# Altium project BlueSat_FlatSat.PrjPCB
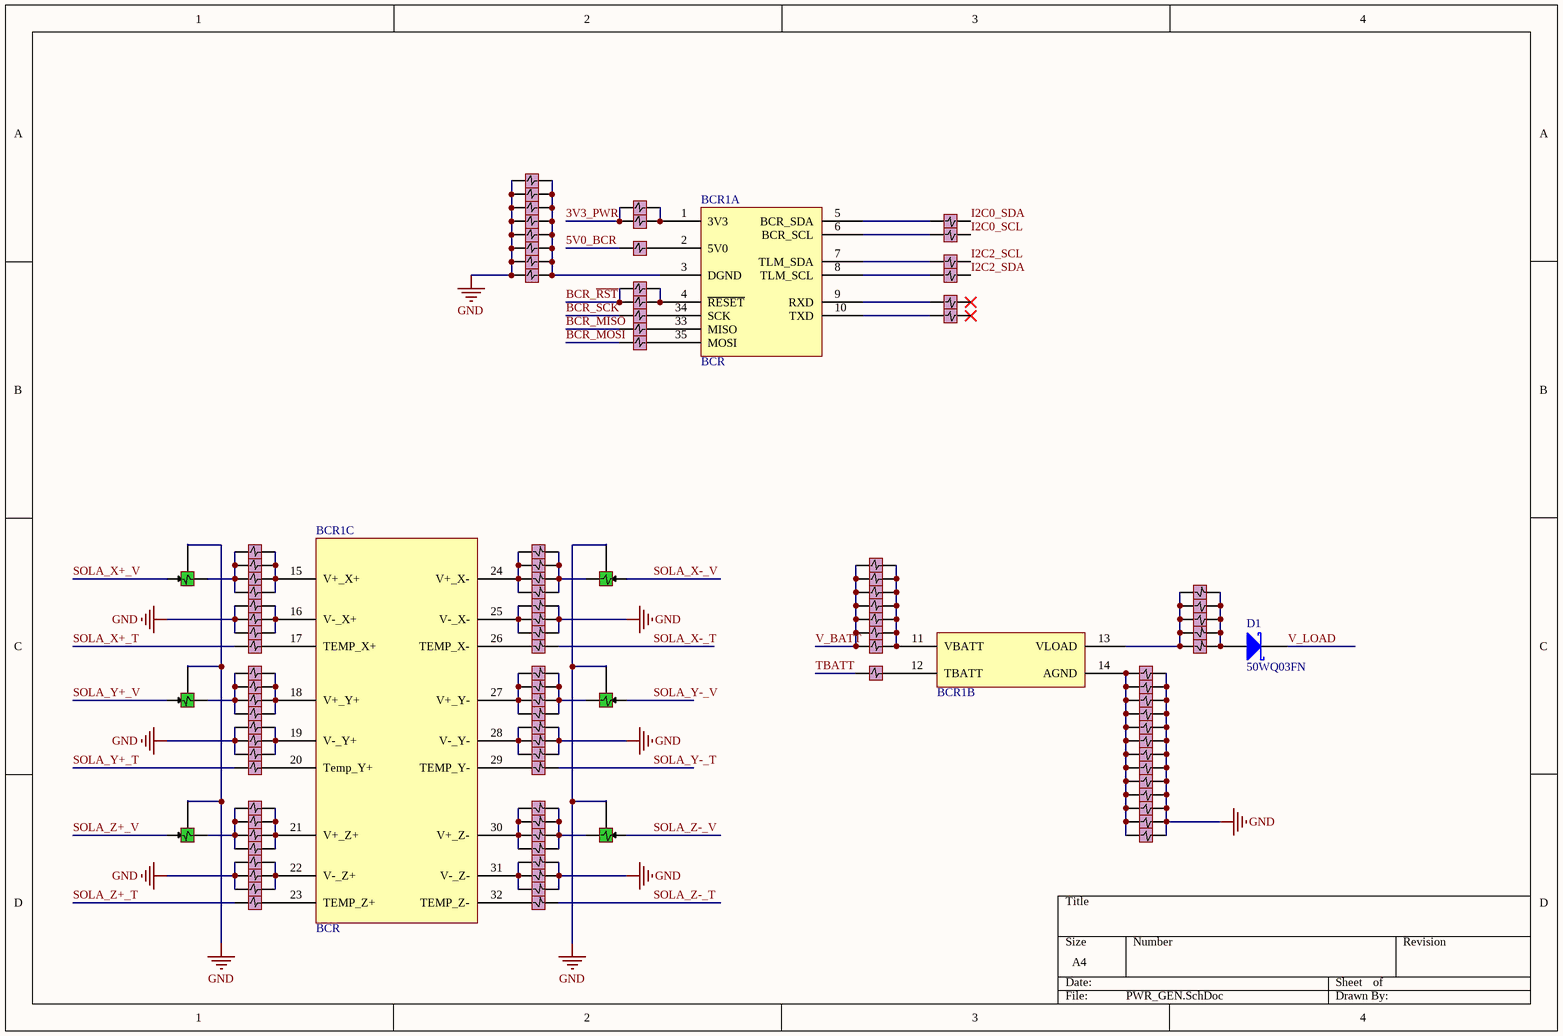
[diagram p0: PWR_GEN.SchDoc]
3 sheets, 393 parts. Net scope: global (net labels, ports and power ports of the same name join across sheets).
Board files: FLATSAT.PcbDoc, CSC_TEMP.PcbDoc, BBONE_TEMP.PcbDoc, COMMS_TEMP.PcbDoc, PWR_REG_TEMP.PcbDoc, PWR_GEN_TEMP.PcbDoc, LAYOUT_TEMP.PcbDoc
Sheets:
  PWR_GEN.SchDoc
  PWR_REG.SchDoc
  LED_INDICATORS.SchDoc

## Sheet PWR_GEN.SchDoc
size A4; DocumentNumber: 1; SheetNumber: 4; SheetTotal: 6

### Parts
BCR1  BCR  [BCR_FLATSAT_BOARD]  (parts A,B,C of 3)
D1  50WQ03FN  [TO229P990X238-3N]
F15  FilterSola  [FILTERSOLA]  (value not drawn)
F16  FilterSola  [FILTERSOLA]  (value not drawn)
F17  FilterSola  [FILTERSOLA]  (value not drawn)
F18  FilterSola  [FILTERSOLA]  (value not drawn)
F19  FilterSola  [FILTERSOLA]  (value not drawn)
F20  FilterSola  [FILTERSOLA]  (value not drawn)
P337  Jumper_Filter  [Jumper_filter]  (value not drawn)
P338  Jumper_Filter  [Jumper_filter]  (value not drawn)
P339  Jumper_Filter  [Jumper_filter]  (value not drawn)
P340  Jumper_Filter  [Jumper_filter]  (value not drawn)
P341  Jumper_Filter  [Jumper_filter]  (value not drawn)
P342  Jumper_Filter  [Jumper_filter]  (value not drawn)
P343  Jumper_Filter  [Jumper_filter]  (value not drawn)
P344  Jumper_Filter  [Jumper_filter]  (value not drawn)
P345  Jumper_Filter  [Jumper_filter]  (value not drawn)
P346  Jumper_Filter  [Jumper_filter]  (value not drawn)
P347  Jumper_Filter  [Jumper_filter]  (value not drawn)
P348  Jumper_Filter  [Jumper_filter]  (value not drawn)
P349  Jumper_Filter  [Jumper_filter]  (value not drawn)
P350  Jumper_Filter  [Jumper_filter]  (value not drawn)
P351  Jumper_Filter  [Jumper_filter]  (value not drawn)
P352  Jumper_Filter  [Jumper_filter]  (value not drawn)
P353  Jumper_Filter  [Jumper_filter]  (value not drawn)
P354  Jumper_Filter  [Jumper_filter]  (value not drawn)
P355  Jumper_Filter  [Jumper_filter]  (value not drawn)
P356  Jumper_Filter  [Jumper_filter]  (value not drawn)
P357  Jumper_Filter  [Jumper_filter]  (value not drawn)
P358  Jumper_Filter  [Jumper_filter]  (value not drawn)
P359  Jumper_Filter  [Jumper_filter]  (value not drawn)
P360  Jumper_Filter  [Jumper_filter]  (value not drawn)
P361  Jumper_Filter  [Jumper_filter]  (value not drawn)
P362  Jumper_Filter  [Jumper_filter]  (value not drawn)
P363  Jumper_Filter  [Jumper_filter]  (value not drawn)
P364  Jumper_Filter  [Jumper_filter]  (value not drawn)
P365  Jumper_Filter  [Jumper_filter]  (value not drawn)
P366  Jumper_Filter  [Jumper_filter]  (value not drawn)
P367  Jumper_Filter  [Jumper_filter]  (value not drawn)
P368  Jumper_Filter  [Jumper_filter]  (value not drawn)
P369  Jumper_Filter  [Jumper_filter]  (value not drawn)
P370  Jumper_Filter  [Jumper_filter]  (value not drawn)
P371  Jumper_Filter  [Jumper_filter]  (value not drawn)
P372  Jumper_Filter  [Jumper_filter]  (value not drawn)
P373  Jumper_Filter  [Jumper_filter]  (value not drawn)
P374  Jumper_Filter  [Jumper_filter]  (value not drawn)
P375  Jumper_Filter  [Jumper_filter]  (value not drawn)
P376  Jumper_Filter  [Jumper_filter]  (value not drawn)
P377  Jumper_Filter  [Jumper_filter]  (value not drawn)
P378  Jumper_Filter  [Jumper_filter]  (value not drawn)
P379  Jumper_Filter  [Jumper_filter]  (value not drawn)
P380  Jumper_Filter  [Jumper_filter]  (value not drawn)
P381  Jumper_Filter  [Jumper_filter]  (value not drawn)
P382  Jumper_Filter  [Jumper_filter]  (value not drawn)
P383  Jumper_Filter  [Jumper_filter]  (value not drawn)
P384  Jumper_Filter  [Jumper_filter]  (value not drawn)
P385  Jumper_Filter  [Jumper_filter]  (value not drawn)
P386  Jumper_Filter  [Jumper_filter]  (value not drawn)
P387  Jumper_Filter  [Jumper_filter]  (value not drawn)
P388  Jumper_Filter  [Jumper_filter]  (value not drawn)
P389  Jumper_Filter  [Jumper_filter]  (value not drawn)
P390  Jumper_Filter  [Jumper_filter]  (value not drawn)
P391  Jumper_Filter  [Jumper_filter]  (value not drawn)
P392  Jumper_Filter  [Jumper_filter]  (value not drawn)
P393  Jumper_Filter  [Jumper_filter]  (value not drawn)
P394  Jumper_Filter  [Jumper_filter]  (value not drawn)
P395  Jumper_Filter  [Jumper_filter]  (value not drawn)
P396  Jumper_Filter  [Jumper_filter]  (value not drawn)
P397  Jumper_Filter  [Jumper_filter]  (value not drawn)
P398  Jumper_Filter  [Jumper_filter]  (value not drawn)
P399  Jumper_Filter  [Jumper_filter]  (value not drawn)
P400  Jumper_Filter  [Jumper_filter]  (value not drawn)
P401  Jumper_Filter  [Jumper_filter]  (value not drawn)
P402  Jumper_Filter  [Jumper_filter]  (value not drawn)
P403  Jumper_Filter  [Jumper_filter]  (value not drawn)
P404  Jumper_Filter  [Jumper_filter]  (value not drawn)
P405  Jumper_Filter  [Jumper_filter]  (value not drawn)
P406  Jumper_Filter  [Jumper_filter]  (value not drawn)
P407  Jumper_Filter  [Jumper_filter]  (value not drawn)
P408  Jumper_Filter  [Jumper_filter]  (value not drawn)
P409  Jumper_Filter  [Jumper_filter]  (value not drawn)
P410  Jumper_Filter  [Jumper_filter]  (value not drawn)
P411  Jumper_Filter  [Jumper_filter]  (value not drawn)
P412  Jumper_Filter  [Jumper_filter]  (value not drawn)
P413  Jumper_Filter  [Jumper_filter]  (value not drawn)
P414  Jumper_Filter  [Jumper_filter]  (value not drawn)
P415  Jumper_Filter  [Jumper_filter]  (value not drawn)
P416  Jumper_Filter  [Jumper_filter]  (value not drawn)
P417  Jumper_Filter  [Jumper_filter]  (value not drawn)
P418  Jumper_Filter  [Jumper_filter]  (value not drawn)
P419  Jumper_Filter  [Jumper_filter]  (value not drawn)
P420  Jumper_Filter  [Jumper_filter]  (value not drawn)
P421  Jumper_Filter  [Jumper_filter]  (value not drawn)
P422  Jumper_Filter  [Jumper_filter]  (value not drawn)
P423  Jumper_Filter  [Jumper_filter]  (value not drawn)
P424  Jumper_Filter  [Jumper_filter]  (value not drawn)
P425  Jumper_Filter  [Jumper_filter]  (value not drawn)
P426  Jumper_Filter  [Jumper_filter]  (value not drawn)
P427  Jumper_Filter  [Jumper_filter]  (value not drawn)
P428  Jumper_Filter  [Jumper_filter]  (value not drawn)
P429  Jumper_Filter  [Jumper_filter]  (value not drawn)
P430  Jumper_Filter  [Jumper_filter]  (value not drawn)
P431  Jumper_Filter  [Jumper_filter]  (value not drawn)
P432  Jumper_Filter  [Jumper_filter]  (value not drawn)

### Nets
GND: F15.3 F16.3 F17.3 F18.3 F19.3 F20.3 P337.3 P338.3 P339.3 P340.3 P341.1 P341.3 P342.1 P342.3 P343.1 P343.3 P344.3 P345.3 P346.3 P347.3 P348.3 P349.1 P349.3 P350.1 P350.3 P351.1 P351.3 P352.3 P353.3 P354.3 P355.3 P356.3 P357.1 P357.3 P358.1 P358.3 P359.1 P359.3 P360.3 P361.1 P361.3 P362.1 P362.3 P363.1 P363.3 P364.1 P364.3 P365.1 P365.3 P366.1 P366.3 P367.1 P367.3 P368.1 P368.3 P369.3 P370.3 P371.3 P372.3 P373.1 P373.3 P374.1 P374.3 P375.1 P375.3 P376.3 P377.3 P378.3 P379.3 P380.3 P381.1 P381.3 P382.1 P382.3 P383.1 P383.3 P384.3 P385.3 P386.3 P387.3 P388.3 P389.1 P389.3 P390.1 P390.3 P391.1 P391.3 P392.3 P393.3 P394.3 P395.3 P396.3 P397.3 P398.3 P399.3 P400.3 P401.3 P402.3 P403.3 P404.3 P405.3 P406.3 P407.3 P408.3 P409.3 P410.3 P411.3 P412.3 P413.3 P414.3 P415.1 P415.3 P416.1 P416.3 P417.1 P417.3 P418.1 P418.3 P419.1 P419.3 P420.1 P420.3 P421.1 P421.3 P422.1 P422.3 P423.1 P423.3 P424.1 P424.3 P425.1 P425.3 P426.1 P426.3 P427.1 P427.3 P428.3 P429.3 P430.3 P431.3 P432.3
V_LOAD: D1.2(K)
3V3_PWR: P393.1 P394.1
5V0_BCR: P395.1
BCR_MISO: P398.1
BCR_MOSI: P400.1
BCR_~{RST}: P396.1 P397.1
BCR_SCK: P399.1
I2C0_SCL: P410.1
I2C0_SDA: P409.1
I2C2_SCL: P411.1
I2C2_SDA: P412.1
SOLA_X+_T: P344.1
SOLA_X+_V: F15.1
SOLA_X-_T: P376.1
SOLA_X-_V: F18.1
SOLA_Y+_T: P352.1
SOLA_Y+_V: F16.1
SOLA_Y-_T: P384.1
SOLA_Y-_V: F19.1
SOLA_Z+_T: P360.1
SOLA_Z+_V: F17.1
SOLA_Z-_T: P392.1
SOLA_Z-_V: F20.1
TBATT: P408.1
V_BATT: P401.1 P402.1 P403.1 P404.1 P405.1 P406.1 P407.1
NetBCR1_1: BCR1.1(3V3) P393.2 P394.2
NetBCR1_2: BCR1.2(5V0) P395.2
NetBCR1_3: BCR1.3(DGND) P361.2 P362.2 P363.2 P364.2 P365.2 P366.2 P367.2 P368.2
NetBCR1_4: BCR1.4(~{RESET}) P396.2 P397.2
NetBCR1_5: BCR1.5(BCR_SDA) P409.2
NetBCR1_6: BCR1.6(BCR_SCL) P410.2
NetBCR1_7: BCR1.7(TLM_SDA) P411.2
NetBCR1_8: BCR1.8(TLM_SCL) P412.2
NetBCR1_9: BCR1.9(RXD) P413.2
NetBCR1_10: BCR1.10(TXD) P414.2
NetBCR1_11: BCR1.11(VBATT) P401.2 P402.2 P403.2 P404.2 P405.2 P406.2 P407.2
NetBCR1_12: BCR1.12(TBATT) P408.2
NetBCR1_13: BCR1.13(VLOAD) P428.2 P429.2 P430.2 P431.2 P432.2
NetBCR1_14: BCR1.14(AGND) P415.2 P416.2 P417.2 P418.2 P419.2 P420.2 P421.2 P422.2 P423.2 P424.2 P425.2 P426.2 P427.2
NetBCR1_15: BCR1.15(V+_X+) P337.2 P338.2 P339.2 P340.2
NetBCR1_16: BCR1.16(V-_X+) P341.2 P342.2 P343.2
NetBCR1_17: BCR1.17(TEMP_X+) P344.2
NetBCR1_18: BCR1.18(V+_Y+) P345.2 P346.2 P347.2 P348.2
NetBCR1_19: BCR1.19(V-_Y+) P349.2 P350.2 P351.2
NetBCR1_20: BCR1.20(Temp_Y+) P352.2
NetBCR1_21: BCR1.21(V+_Z+) P353.2 P354.2 P355.2 P356.2
NetBCR1_22: BCR1.22(V-_Z+) P357.2 P358.2 P359.2
NetBCR1_23: BCR1.23(TEMP_Z+) P360.2
NetBCR1_24: BCR1.24(V+_X-) P369.2 P370.2 P371.2 P372.2
NetBCR1_25: BCR1.25(V-_X-) P373.2 P374.2 P375.2
NetBCR1_26: BCR1.26(TEMP_X-) P376.2
NetBCR1_27: BCR1.27(V+_Y-) P377.2 P378.2 P379.2 P380.2
NetBCR1_28: BCR1.28(V-_Y-) P381.2 P382.2 P383.2
NetBCR1_29: BCR1.29(TEMP_Y-) P384.2
NetBCR1_30: BCR1.30(V+_Z-) P385.2 P386.2 P387.2 P388.2
NetBCR1_31: BCR1.31(V-_Z-) P389.2 P390.2 P391.2
NetBCR1_32: BCR1.32(TEMP_Z-) P392.2
NetBCR1_33: BCR1.33(MISO) P398.2
NetBCR1_34: BCR1.34(SCK) P399.2
NetBCR1_35: BCR1.35(MOSI) P400.2
NetD1_1: D1.1(A) P428.1 P429.1 P430.1 P431.1 P432.1
NetF15_2: F15.2 P337.1 P338.1 P339.1 P340.1
NetF16_2: F16.2 P345.1 P346.1 P347.1 P348.1
NetF17_2: F17.2 P353.1 P354.1 P355.1 P356.1
NetF18_2: F18.2 P369.1 P370.1 P371.1 P372.1
NetF19_2: F19.2 P377.1 P378.1 P379.1 P380.1
NetF20_2: F20.2 P385.1 P386.1 P387.1 P388.1

Not connected (* = marked no-connect by the designer): P413 1*; P414 1*

### Library data of the parts
D1 = D Schottky: Schottky Diode; Published: 8-Jun-2000; LatestRevisionDate: 17-Jul-2002; LatestRevisionNote: Re-released for DXP Platform.; PackageReference: SMB; Publisher: Altium Limited; PackageDescription: DO-214-AA/SMB; 2 C-Bend Leads; Body 5.3 x 3.6 mm, inc. leads (LxW); Code_JEDEC: DO-214-AA

## Sheet PWR_REG.SchDoc
size A4; DocumentNumber: 1; SheetNumber: 5; SheetTotal: 6
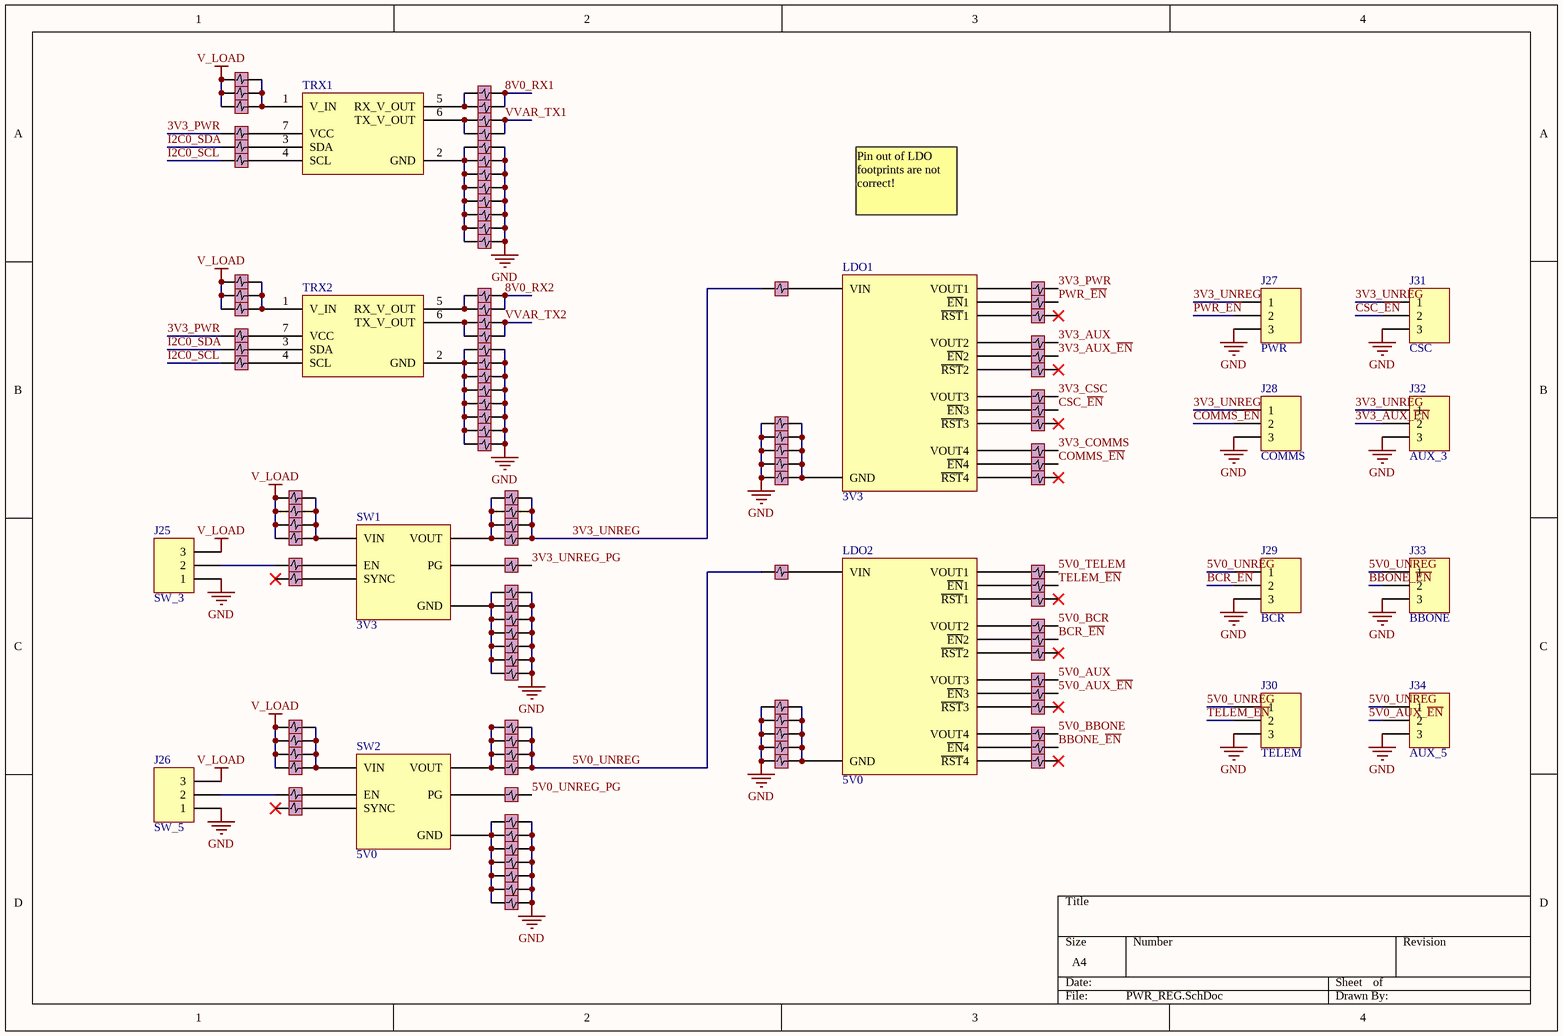
[diagram p1: PWR_REG.SchDoc]

### Parts
J25  SW_3  [HDR1X3]
J26  SW_5  [HDR1X3]
J27  PWR  [HDR1X3]
J28  COMMS  [HDR1X3]
J29  BCR  [HDR1X3]
J30  TELEM  [HDR1X3]
J31  CSC  [HDR1X3]
J32  AUX_3  [HDR1X3]
J33  BBONE  [HDR1X3]
J34  AUX_5  [HDR1X3]
LDO1  3V3  [LDO]
LDO2  5V0  [LDO]
P433  Jumper_Filter  [Jumper_filter]  (value not drawn)
P434  Jumper_Filter  [Jumper_filter]  (value not drawn)
P435  Jumper_Filter  [Jumper_filter]  (value not drawn)
P436  Jumper_Filter  [Jumper_filter]  (value not drawn)
P437  Jumper_Filter  [Jumper_filter]  (value not drawn)
P438  Jumper_Filter  [Jumper_filter]  (value not drawn)
P439  Jumper_Filter  [Jumper_filter]  (value not drawn)
P440  Jumper_Filter  [Jumper_filter]  (value not drawn)
P441  Jumper_Filter  [Jumper_filter]  (value not drawn)
P442  Jumper_Filter  [Jumper_filter]  (value not drawn)
P443  Jumper_Filter  [Jumper_filter]  (value not drawn)
P444  Jumper_Filter  [Jumper_filter]  (value not drawn)
P445  Jumper_Filter  [Jumper_filter]  (value not drawn)
P446  Jumper_Filter  [Jumper_filter]  (value not drawn)
P447  Jumper_Filter  [Jumper_filter]  (value not drawn)
P448  Jumper_Filter  [Jumper_filter]  (value not drawn)
P449  Jumper_Filter  [Jumper_filter]  (value not drawn)
P450  Jumper_Filter  [Jumper_filter]  (value not drawn)
P451  Jumper_Filter  [Jumper_filter]  (value not drawn)
P452  Jumper_Filter  [Jumper_filter]  (value not drawn)
P453  Jumper_Filter  [Jumper_filter]  (value not drawn)
P454  Jumper_Filter  [Jumper_filter]  (value not drawn)
P455  Jumper_Filter  [Jumper_filter]  (value not drawn)
P456  Jumper_Filter  [Jumper_filter]  (value not drawn)
P457  Jumper_Filter  [Jumper_filter]  (value not drawn)
P458  Jumper_Filter  [Jumper_filter]  (value not drawn)
P459  Jumper_Filter  [Jumper_filter]  (value not drawn)
P460  Jumper_Filter  [Jumper_filter]  (value not drawn)
P461  Jumper_Filter  [Jumper_filter]  (value not drawn)
P462  Jumper_Filter  [Jumper_filter]  (value not drawn)
P463  Jumper_Filter  [Jumper_filter]  (value not drawn)
P464  Jumper_Filter  [Jumper_filter]  (value not drawn)
P465  Jumper_Filter  [Jumper_filter]  (value not drawn)
P466  Jumper_Filter  [Jumper_filter]  (value not drawn)
P467  Jumper_Filter  [Jumper_filter]  (value not drawn)
P468  Jumper_Filter  [Jumper_filter]  (value not drawn)
P469  Jumper_Filter  [Jumper_filter]  (value not drawn)
P470  Jumper_Filter  [Jumper_filter]  (value not drawn)
P471  Jumper_Filter  [Jumper_filter]  (value not drawn)
P472  Jumper_Filter  [Jumper_filter]  (value not drawn)
P473  Jumper_Filter  [Jumper_filter]  (value not drawn)
P474  Jumper_Filter  [Jumper_filter]  (value not drawn)
P475  Jumper_Filter  [Jumper_filter]  (value not drawn)
P476  Jumper_Filter  [Jumper_filter]  (value not drawn)
P477  Jumper_Filter  [Jumper_filter]  (value not drawn)
P478  Jumper_Filter  [Jumper_filter]  (value not drawn)
P479  Jumper_Filter  [Jumper_filter]  (value not drawn)
P480  Jumper_Filter  [Jumper_filter]  (value not drawn)
P481  Jumper_Filter  [Jumper_filter]  (value not drawn)
P482  Jumper_Filter  [Jumper_filter]  (value not drawn)
P483  Jumper_Filter  [Jumper_filter]  (value not drawn)
P484  Jumper_Filter  [Jumper_filter]  (value not drawn)
P485  Jumper_Filter  [Jumper_filter]  (value not drawn)
P486  Jumper_Filter  [Jumper_filter]  (value not drawn)
P487  Jumper_Filter  [Jumper_filter]  (value not drawn)
P488  Jumper_Filter  [Jumper_filter]  (value not drawn)
P489  Jumper_Filter  [Jumper_filter]  (value not drawn)
P490  Jumper_Filter  [Jumper_filter]  (value not drawn)
P491  Jumper_Filter  [Jumper_filter]  (value not drawn)
P492  Jumper_Filter  [Jumper_filter]  (value not drawn)
P493  Jumper_Filter  [Jumper_filter]  (value not drawn)
P494  Jumper_Filter  [Jumper_filter]  (value not drawn)
P495  Jumper_Filter  [Jumper_filter]  (value not drawn)
P496  Jumper_Filter  [Jumper_filter]  (value not drawn)
P497  Jumper_Filter  [Jumper_filter]  (value not drawn)
P498  Jumper_Filter  [Jumper_filter]  (value not drawn)
P499  Jumper_Filter  [Jumper_filter]  (value not drawn)
P500  Jumper_Filter  [Jumper_filter]  (value not drawn)
P501  Jumper_Filter  [Jumper_filter]  (value not drawn)
P502  Jumper_Filter  [Jumper_filter]  (value not drawn)
P503  Jumper_Filter  [Jumper_filter]  (value not drawn)
P504  Jumper_Filter  [Jumper_filter]  (value not drawn)
P505  Jumper_Filter  [Jumper_filter]  (value not drawn)
P506  Jumper_Filter  [Jumper_filter]  (value not drawn)
P507  Jumper_Filter  [Jumper_filter]  (value not drawn)
P508  Jumper_Filter  [Jumper_filter]  (value not drawn)
P509  Jumper_Filter  [Jumper_filter]  (value not drawn)
P510  Jumper_Filter  [Jumper_filter]  (value not drawn)
P511  Jumper_Filter  [Jumper_filter]  (value not drawn)
P512  Jumper_Filter  [Jumper_filter]  (value not drawn)
P513  Jumper_Filter  [Jumper_filter]  (value not drawn)
P514  Jumper_Filter  [Jumper_filter]  (value not drawn)
P515  Jumper_Filter  [Jumper_filter]  (value not drawn)
P516  Jumper_Filter  [Jumper_filter]  (value not drawn)
P517  Jumper_Filter  [Jumper_filter]  (value not drawn)
P518  Jumper_Filter  [Jumper_filter]  (value not drawn)
P519  Jumper_Filter  [Jumper_filter]  (value not drawn)
P520  Jumper_Filter  [Jumper_filter]  (value not drawn)
P521  Jumper_Filter  [Jumper_filter]  (value not drawn)
P522  Jumper_Filter  [Jumper_filter]  (value not drawn)
P523  Jumper_Filter  [Jumper_filter]  (value not drawn)
P524  Jumper_Filter  [Jumper_filter]  (value not drawn)
P525  Jumper_Filter  [Jumper_filter]  (value not drawn)
P526  Jumper_Filter  [Jumper_filter]  (value not drawn)
P527  Jumper_Filter  [Jumper_filter]  (value not drawn)
P528  Jumper_Filter  [Jumper_filter]  (value not drawn)
P529  Jumper_Filter  [Jumper_filter]  (value not drawn)
P530  Jumper_Filter  [Jumper_filter]  (value not drawn)
P531  Jumper_Filter  [Jumper_filter]  (value not drawn)
P532  Jumper_Filter  [Jumper_filter]  (value not drawn)
P533  Jumper_Filter  [Jumper_filter]  (value not drawn)
P534  Jumper_Filter  [Jumper_filter]  (value not drawn)
P535  Jumper_Filter  [Jumper_filter]  (value not drawn)
P536  Jumper_Filter  [Jumper_filter]  (value not drawn)
P537  Jumper_Filter  [Jumper_filter]  (value not drawn)
P538  Jumper_Filter  [Jumper_filter]  (value not drawn)
P539  Jumper_Filter  [Jumper_filter]  (value not drawn)
P540  Jumper_Filter  [Jumper_filter]  (value not drawn)
SW1  3V3  [LVSwitcher]
SW2  5V0  [LVSwitcher]
TRX1  TRX_REGULATOR  [TRX_REGULATOR]  (value not drawn)
TRX2  TRX_REGULATOR  [TRX_REGULATOR]  (value not drawn)

### Nets
3V3_UNREG: J27.1 J28.1 J31.1 J32.1 P481.1 P482.1 P483.1 P484.1 P505.1
GND: J25.1 J26.1 J27.3 J28.3 J29.3 J30.3 J31.3 J32.3 J33.3 J34.3 P433.3 P434.3 P435.3 P436.3 P437.3 P438.3 P439.3 P440.3 P441.3 P442.3 P443.3 P444.3 P445.3 P446.3 P447.3 P448.3 P449.3 P450.3 P451.3 P452.3 P453.3 P454.3 P455.3 P456.3 P457.3 P458.3 P459.3 P460.3 P461.1 P461.3 P462.1 P462.3 P463.1 P463.3 P464.1 P464.3 P465.1 P465.3 P466.1 P466.3 P467.1 P467.3 P468.1 P468.3 P469.3 P470.3 P471.3 P472.3 P473.1 P473.3 P474.1 P474.3 P475.1 P475.3 P476.1 P476.3 P477.1 P477.3 P478.1 P478.3 P479.1 P479.3 P480.1 P480.3 P481.3 P482.3 P483.3 P484.3 P485.3 P486.1 P486.3 P487.1 P487.3 P488.1 P488.3 P489.1 P489.3 P490.1 P490.3 P491.1 P491.3 P492.1 P492.3 P493.3 P494.3 P495.3 P496.3 P497.3 P498.1 P498.3 P499.1 P499.3 P500.1 P500.3 P501.1 P501.3 P502.1 P502.3 P503.1 P503.3 P504.1 P504.3 P505.3 P506.1 P506.3 P507.1 P507.3 P508.1 P508.3 P509.1 P509.3 P510.1 P510.3 P511.3 P512.1 P512.3 P513.1 P513.3 P514.1 P514.3 P515.1 P515.3 P516.1 P516.3 P517.3 P518.3 P519.3 P520.3 P521.3 P522.3 P523.3 P524.3 P525.3 P526.3 P527.3 P528.3 P529.3 P530.3 P531.3 P532.3 P533.3 P534.3 P535.3 P536.3 P537.3 P538.3 P539.3 P540.3
V_LOAD: J25.3 J26.3 P433.1 P434.1 P435.1 P439.1 P440.1 P441.1 P445.1 P446.1 P447.1 P448.1 P451.1 P452.1 P453.1 P454.1
3V3_AUX: P520.1
3V3_AUX_~{EN}: J32.2 P521.1
3V3_COMMS: P526.1
3V3_CSC: P523.1
3V3_PWR: P436.1 P442.1 P517.1
3V3_UNREG_PG: P485.1
5V0_AUX: P535.1
5V0_AUX_~{EN}: J34.2 P536.1
5V0_BBONE: P538.1
5V0_BCR: P532.1
5V0_TELEM: P529.1
5V0_UNREG: J29.1 J30.1 J33.1 J34.1 P493.1 P494.1 P495.1 P496.1 P511.1
5V0_UNREG_PG: P497.1
8V0_RX1: P457.1 P458.1
8V0_RX2: P469.1 P470.1
BBONE_~{EN}: J33.2 P539.1
BCR_~{EN}: J29.2 P533.1
COMMS_~{EN}: J28.2 P527.1
CSC_~{EN}: J31.2 P524.1
I2C0_SCL: P438.1 P444.1
I2C0_SDA: P437.1 P443.1
PWR_~{EN}: J27.2 P518.1
TELEM_~{EN}: J30.2 P530.1
VVAR_TX1: P459.1 P460.1
VVAR_TX2: P471.1 P472.1
NetJ25_2: J25.2 P449.1
NetJ26_2: J26.2 P455.1
NetLDO1_EN1: LDO1.EN1(~{EN}1) P518.2
NetLDO1_EN2: LDO1.EN2(~{EN}2) P521.2
NetLDO1_EN3: LDO1.EN3(~{EN}3) P524.2
NetLDO1_EN4: LDO1.EN4(~{EN}4) P527.2
NetLDO1_GND: LDO1.GND P506.2 P507.2 P508.2 P509.2 P510.2
NetLDO1_RST1: LDO1.RST1(~{RST}1) P519.2
NetLDO1_RST2: LDO1.RST2(~{RST}2) P522.2
NetLDO1_RST3: LDO1.RST3(~{RST}3) P525.2
NetLDO1_RST4: LDO1.RST4(~{RST}4) P528.2
NetLDO1_VIN: LDO1.VIN P505.2
NetLDO1_VOUT1: LDO1.VOUT1 P517.2
NetLDO1_VOUT2: LDO1.VOUT2 P520.2
NetLDO1_VOUT3: LDO1.VOUT3 P523.2
NetLDO1_VOUT4: LDO1.VOUT4 P526.2
NetLDO2_EN1: LDO2.EN1(~{EN}1) P530.2
NetLDO2_EN2: LDO2.EN2(~{EN}2) P533.2
NetLDO2_EN3: LDO2.EN3(~{EN}3) P536.2
NetLDO2_EN4: LDO2.EN4(~{EN}4) P539.2
NetLDO2_GND: LDO2.GND P512.2 P513.2 P514.2 P515.2 P516.2
NetLDO2_RST1: LDO2.RST1(~{RST}1) P531.2
NetLDO2_RST2: LDO2.RST2(~{RST}2) P534.2
NetLDO2_RST3: LDO2.RST3(~{RST}3) P537.2
NetLDO2_RST4: LDO2.RST4(~{RST}4) P540.2
NetLDO2_VIN: LDO2.VIN P511.2
NetLDO2_VOUT1: LDO2.VOUT1 P529.2
NetLDO2_VOUT2: LDO2.VOUT2 P532.2
NetLDO2_VOUT3: LDO2.VOUT3 P535.2
NetLDO2_VOUT4: LDO2.VOUT4 P538.2
NetP433_2: P433.2 P434.2 P435.2 TRX1.1(V_IN)
NetP436_2: P436.2 TRX1.7(VCC)
NetP437_2: P437.2 TRX1.3(SDA)
NetP438_2: P438.2 TRX1.4(SCL)
NetP439_2: P439.2 P440.2 P441.2 TRX2.1(V_IN)
NetP442_2: P442.2 TRX2.7(VCC)
NetP443_2: P443.2 TRX2.3(SDA)
NetP444_2: P444.2 TRX2.4(SCL)
NetP445_2: P445.2 P446.2 P447.2 P448.2 SW1.Vin(VIN)
NetP449_2: P449.2 SW1.EN
NetP450_2: P450.2 SW1.SYNC
NetP451_2: P451.2 P452.2 P453.2 P454.2 SW2.Vin(VIN)
NetP455_2: P455.2 SW2.EN
NetP456_2: P456.2 SW2.SYNC
NetP457_2: P457.2 P458.2 TRX1.5(RX_V_OUT)
NetP459_2: P459.2 P460.2 TRX1.6(TX_V_OUT)
NetP461_2: P461.2 P462.2 P463.2 P464.2 P465.2 P466.2 P467.2 P468.2 TRX1.2(GND)
NetP469_2: P469.2 P470.2 TRX2.5(RX_V_OUT)
NetP471_2: P471.2 P472.2 TRX2.6(TX_V_OUT)
NetP473_2: P473.2 P474.2 P475.2 P476.2 P477.2 P478.2 P479.2 P480.2 TRX2.2(GND)
NetP481_2: P481.2 P482.2 P483.2 P484.2 SW1.Vout(VOUT)
NetP485_2: P485.2 SW1.PG
NetP486_2: P486.2 P487.2 P488.2 P489.2 P490.2 P491.2 P492.2 SW1.GND
NetP493_2: P493.2 P494.2 P495.2 P496.2 SW2.Vout(VOUT)
NetP497_2: P497.2 SW2.PG
NetP498_2: P498.2 P499.2 P500.2 P501.2 P502.2 P503.2 P504.2 SW2.GND

Not connected (* = marked no-connect by the designer): P450 1*; P456 1*; P519 1*; P522 1*; P525 1*; P528 1*; P531 1*; P534 1*; P537 1*; P540 1*

### Notes on the sheet
- Pin out of LDO footprints are not correct!

### Library data of the parts
J25-J34 = Header 3: Header, 3-Pin; LatestRevisionNote: Re-released for DXP Platform.; Publisher: Altium Limited
  J25: ClassName: SW1
  J26: LatestRevisionDate: 17-Jul-2002; ClassName: SW2
  J27 J28 J31 J32: LatestRevisionDate: 17-Jul-2002; ClassName: LDO1
  J29 J30 J33 J34: LatestRevisionDate: 17-Jul-2002; ClassName: LDO2
LDO1 LDO2 = LDO
  LDO1: ClassName: LDO1
  LDO2: ClassName: LDO2
SW1 SW2 = LVSWITCHER
  SW1: ClassName: SW1
  SW2: ClassName: SW2
P433-P540 = Jumper_Filter
  P433-P438 P457-P468: ClassName: TRX1
  P439-P444 P469-P480: ClassName: TRX2
  P445-P450 P481-P492: ClassName: SW1
  P451-P456 P493-P504: ClassName: SW2
  P505-P510 P517-P528: ClassName: LDO1
  P511-P516 P529-P540: ClassName: LDO2
TRX1 TRX2 = TRX_REGULATOR
  TRX1: ClassName: TRX1
  TRX2: ClassName: TRX2

## Sheet LED_INDICATORS.SchDoc
size A3 portrait
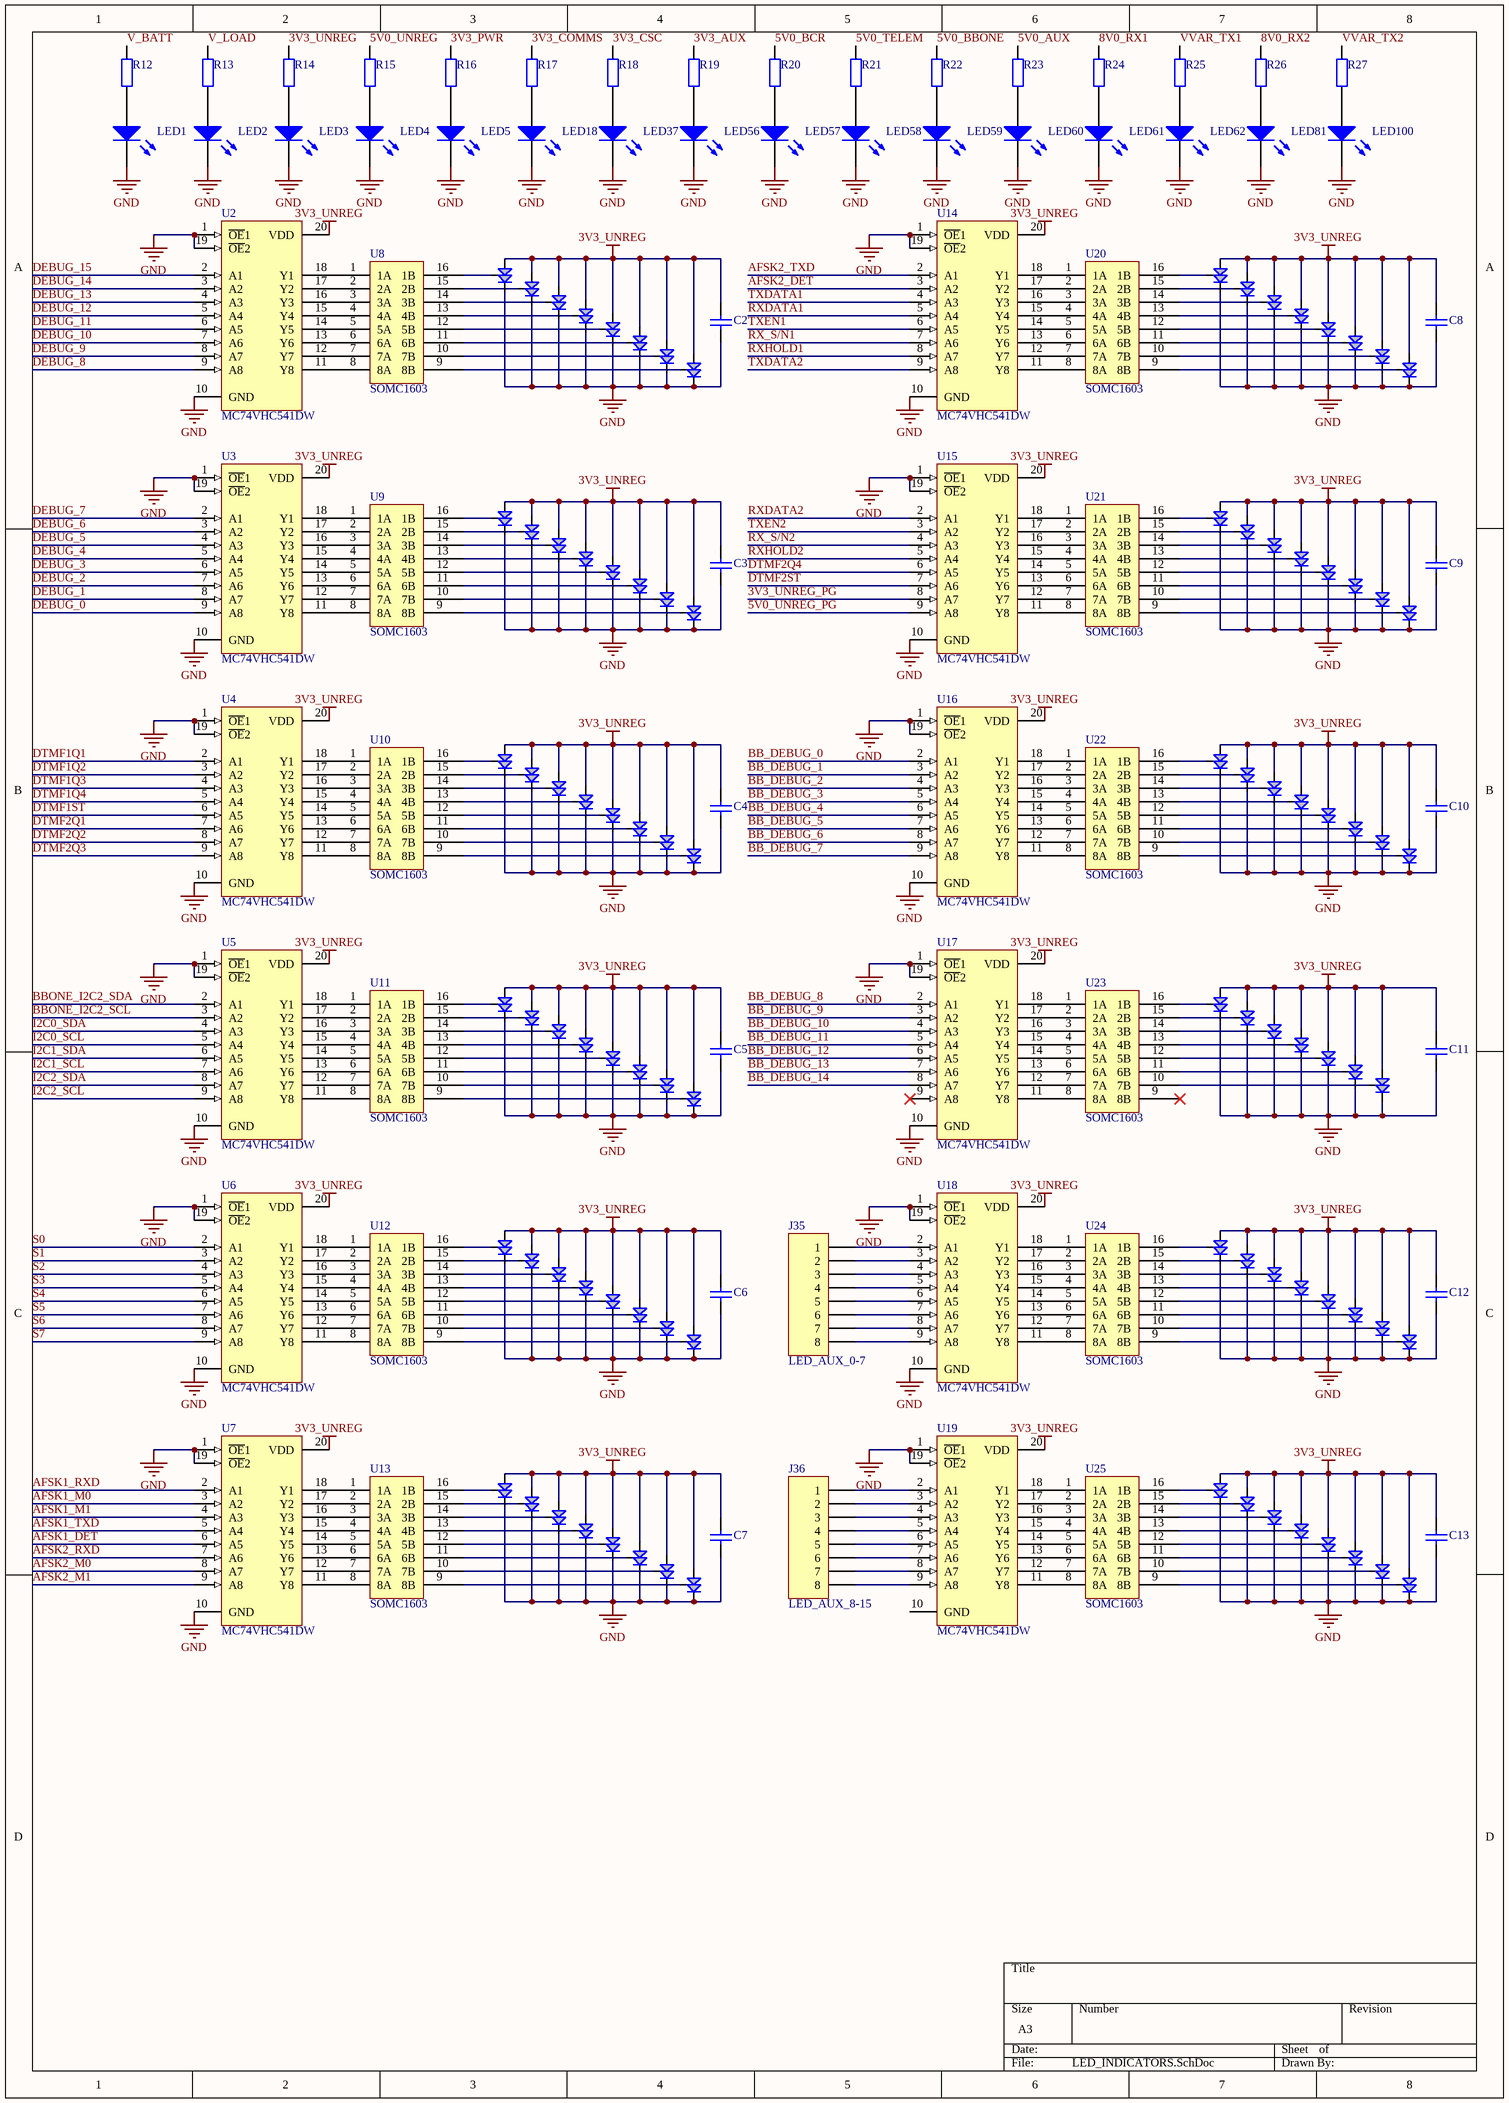
[diagram p2: LED_INDICATORS.SchDoc]

### Parts
C2  (no value)  [6-0805_M]
C3  (no value)  [6-0805_M]
C4  (no value)  [6-0805_M]
C5  (no value)  [6-0805_M]
C6  (no value)  [6-0805_M]
C7  (no value)  [6-0805_M]
C8  (no value)  [6-0805_M]
C9  (no value)  [6-0805_M]
C10  (no value)  [6-0805_M]
C11  (no value)  [6-0805_M]
C12  (no value)  [6-0805_M]
C13  (no value)  [6-0805_M]
J35  LED_AUX_0-7  [HDR1X8]
J36  LED_AUX_8-15  [HDR1X8]
LED1  V_BATT  [6-0805_M]  (value not drawn)
LED2  V_LOAD  [6-0805_M]  (value not drawn)
LED3  3V3_UNREG  [6-0805_M]  (value not drawn)
LED4  5V0_UNREG  [6-0805_M]  (value not drawn)
LED5  3V3_PWR  [6-0805_M]  (value not drawn)
LED6  DEBUG_15  [BIDIRECTIONAL LED]  (value not drawn)
LED7  DEBUG_7  [BIDIRECTIONAL LED]  (value not drawn)
LED8  DTMF1Q1  [BIDIRECTIONAL LED]  (value not drawn)
LED9  DTMF2Q4  [BIDIRECTIONAL LED]  (value not drawn)
LED10  S0  [BIDIRECTIONAL LED]  (value not drawn)
LED11  AFSK1_RXD  [BIDIRECTIONAL LED]  (value not drawn)
LED12  DEBUG_14  [BIDIRECTIONAL LED]  (value not drawn)
LED13  DEBUG_6  [BIDIRECTIONAL LED]  (value not drawn)
LED14  DTMF1Q2  [BIDIRECTIONAL LED]  (value not drawn)
LED15  DTMF2ST  [BIDIRECTIONAL LED]  (value not drawn)
LED16  S1  [BIDIRECTIONAL LED]  (value not drawn)
LED17  AFSK1_M0  [BIDIRECTIONAL LED]  (value not drawn)
LED18  3V3_COMMS  [6-0805_M]  (value not drawn)
LED19  DEBUG_13  [BIDIRECTIONAL LED]  (value not drawn)
LED20  DEBUG_5  [BIDIRECTIONAL LED]  (value not drawn)
LED21  DTMF1Q3  [BIDIRECTIONAL LED]  (value not drawn)
LED22  I2C0_SDA  [BIDIRECTIONAL LED]  (value not drawn)
LED23  S2  [BIDIRECTIONAL LED]  (value not drawn)
LED24  AFSK1_M1  [BIDIRECTIONAL LED]  (value not drawn)
LED25  DEBUG_12  [BIDIRECTIONAL LED]  (value not drawn)
LED26  DEBUG_4  [BIDIRECTIONAL LED]  (value not drawn)
LED27  DTMF1Q4  [BIDIRECTIONAL LED]  (value not drawn)
LED28  I2C0_SCL  [BIDIRECTIONAL LED]  (value not drawn)
LED29  S3  [BIDIRECTIONAL LED]  (value not drawn)
LED30  AFSK1_TXD  [BIDIRECTIONAL LED]  (value not drawn)
LED31  DEBUG_11  [BIDIRECTIONAL LED]  (value not drawn)
LED32  DEBUG_3  [BIDIRECTIONAL LED]  (value not drawn)
LED33  DTMF1ST  [BIDIRECTIONAL LED]  (value not drawn)
LED34  I2C1_SDA  [BIDIRECTIONAL LED]  (value not drawn)
LED35  S4  [BIDIRECTIONAL LED]  (value not drawn)
LED36  AFSK1_DET  [BIDIRECTIONAL LED]  (value not drawn)
LED37  3V3_CSC  [6-0805_M]  (value not drawn)
LED38  DEBUG_10  [BIDIRECTIONAL LED]  (value not drawn)
LED39  DEBUG_2  [BIDIRECTIONAL LED]  (value not drawn)
LED40  DTMF2Q1  [BIDIRECTIONAL LED]  (value not drawn)
LED41  I2C1_SCL  [BIDIRECTIONAL LED]  (value not drawn)
LED42  S5  [BIDIRECTIONAL LED]  (value not drawn)
LED43  AFSK2_RXD  [BIDIRECTIONAL LED]  (value not drawn)
LED44  DEBUG_9  [BIDIRECTIONAL LED]  (value not drawn)
LED45  DEBUG_1  [BIDIRECTIONAL LED]  (value not drawn)
LED46  DTMF2Q2  [BIDIRECTIONAL LED]  (value not drawn)
LED47  I2C2_SDA  [BIDIRECTIONAL LED]  (value not drawn)
LED48  S6  [BIDIRECTIONAL LED]  (value not drawn)
LED49  AFSK2_M0  [BIDIRECTIONAL LED]  (value not drawn)
LED50  DEBUG_8  [BIDIRECTIONAL LED]  (value not drawn)
LED51  DEBUG_0  [BIDIRECTIONAL LED]  (value not drawn)
LED52  DTMF2Q3  [BIDIRECTIONAL LED]  (value not drawn)
LED53  I2C2_SCL  [BIDIRECTIONAL LED]  (value not drawn)
LED54  S7  [BIDIRECTIONAL LED]  (value not drawn)
LED55  AFSK2_M1  [BIDIRECTIONAL LED]  (value not drawn)
LED56  3V3_AUX  [6-0805_M]  (value not drawn)
LED57  5V0_BCR  [6-0805_M]  (value not drawn)
LED58  5V0_TELEM  [6-0805_M]  (value not drawn)
LED59  5V0_BBONE  [6-0805_M]  (value not drawn)
LED60  5V0_AUX  [6-0805_M]  (value not drawn)
LED61  8V0_RX1  [6-0805_M]  (value not drawn)
LED62  VVAR_TX1  [6-0805_M]  (value not drawn)
LED63  AFSK2_TXD  [BIDIRECTIONAL LED]  (value not drawn)
LED64  RXDATA2  [BIDIRECTIONAL LED]  (value not drawn)
LED65  BB_DEBUG_0  [BIDIRECTIONAL LED]  (value not drawn)
LED66  BB_DEBUG_8  [BIDIRECTIONAL LED]  (value not drawn)
LED67  LED_AUX_0  [BIDIRECTIONAL LED]  (value not drawn)
LED68  LED_AUX_8  [BIDIRECTIONAL LED]  (value not drawn)
LED69  AFSK2_DET  [BIDIRECTIONAL LED]  (value not drawn)
LED70  TXEN2  [BIDIRECTIONAL LED]  (value not drawn)
LED71  BB_DEBUG_1  [BIDIRECTIONAL LED]  (value not drawn)
LED72  BB_DEBUG_9  [BIDIRECTIONAL LED]  (value not drawn)
LED73  LED_AUX_1  [BIDIRECTIONAL LED]  (value not drawn)
LED74  LED_AUX_9  [BIDIRECTIONAL LED]  (value not drawn)
LED75  TXDATA1  [BIDIRECTIONAL LED]  (value not drawn)
LED76  RX_S/N2  [BIDIRECTIONAL LED]  (value not drawn)
LED77  BB_DEBUG_2  [BIDIRECTIONAL LED]  (value not drawn)
LED78  BB_DEBUG_10  [BIDIRECTIONAL LED]  (value not drawn)
LED79  LED_AUX_2  [BIDIRECTIONAL LED]  (value not drawn)
LED80  LED_AUX_10  [BIDIRECTIONAL LED]  (value not drawn)
LED81  8V0_RX2  [6-0805_M]  (value not drawn)
LED82  RXDATA1  [BIDIRECTIONAL LED]  (value not drawn)
LED83  RXHOLD2  [BIDIRECTIONAL LED]  (value not drawn)
LED84  BB_DEBUG_3  [BIDIRECTIONAL LED]  (value not drawn)
LED85  BB_DEBUG_11  [BIDIRECTIONAL LED]  (value not drawn)
LED86  LED_AUX_3  [BIDIRECTIONAL LED]  (value not drawn)
LED87  LED_AUX_11  [BIDIRECTIONAL LED]  (value not drawn)
LED88  TXEN1  [BIDIRECTIONAL LED]  (value not drawn)
LED89  BBONE_I2C2_SDA  [BIDIRECTIONAL LED]  (value not drawn)
LED90  BB_DEBUG_4  [BIDIRECTIONAL LED]  (value not drawn)
LED91  BB_DEBUG_12  [BIDIRECTIONAL LED]  (value not drawn)
LED92  LED_AUX_4  [BIDIRECTIONAL LED]  (value not drawn)
LED93  LED_AUX_12  [BIDIRECTIONAL LED]  (value not drawn)
LED94  RX_S/N1  [BIDIRECTIONAL LED]  (value not drawn)
LED95  BBONE_I2C2_SCL  [BIDIRECTIONAL LED]  (value not drawn)
LED96  BB_DEBUG_5  [BIDIRECTIONAL LED]  (value not drawn)
LED97  BB_DEBUG_13  [BIDIRECTIONAL LED]  (value not drawn)
LED98  LED_AUX_5  [BIDIRECTIONAL LED]  (value not drawn)
LED99  LED_AUX_13  [BIDIRECTIONAL LED]  (value not drawn)
LED100  VVAR_TX2  [6-0805_M]  (value not drawn)
LED101  RXHOLD1  [BIDIRECTIONAL LED]  (value not drawn)
LED102  3V3_UNREG_PG  [BIDIRECTIONAL LED]  (value not drawn)
LED103  BB_DEBUG_6  [BIDIRECTIONAL LED]  (value not drawn)
LED104  BB_DEBUG_14  [BIDIRECTIONAL LED]  (value not drawn)
LED105  LED_AUX_6  [BIDIRECTIONAL LED]  (value not drawn)
LED106  LED_AUX_14  [BIDIRECTIONAL LED]  (value not drawn)
LED107  TXDATA2  [BIDIRECTIONAL LED]  (value not drawn)
LED108  5V0_UNREG_PG  [BIDIRECTIONAL LED]  (value not drawn)
LED109  BB_DEBUG_7  [BIDIRECTIONAL LED]  (value not drawn)
LED111  LED_AUX_7  [BIDIRECTIONAL LED]  (value not drawn)
LED112  LED_AUX_15  [BIDIRECTIONAL LED]  (value not drawn)
R12  Res2  [6-0805_M]  (value not drawn)
R13  Res2  [6-0805_M]  (value not drawn)
R14  Res2  [6-0805_M]  (value not drawn)
R15  Res2  [6-0805_M]  (value not drawn)
R16  Res2  [6-0805_M]  (value not drawn)
R17  Res2  [6-0805_M]  (value not drawn)
R18  Res2  [6-0805_M]  (value not drawn)
R19  Res2  [6-0805_M]  (value not drawn)
R20  Res2  [6-0805_M]  (value not drawn)
R21  Res2  [6-0805_M]  (value not drawn)
R22  Res2  [6-0805_M]  (value not drawn)
R23  Res2  [6-0805_M]  (value not drawn)
R24  Res2  [6-0805_M]  (value not drawn)
R25  Res2  [6-0805_M]  (value not drawn)
R26  Res2  [6-0805_M]  (value not drawn)
R27  Res2  [6-0805_M]  (value not drawn)
U2  MC74VHC541DW  [751D-04_M]
U3  MC74VHC541DW  [751D-04_M]
U4  MC74VHC541DW  [751D-04_M]
U5  MC74VHC541DW  [751D-04_M]
U6  MC74VHC541DW  [751D-04_M]
U7  MC74VHC541DW  [751D-04_M]
U8  SOMC1603  [SOMC1603]
U9  SOMC1603  [SOMC1603]
U10  SOMC1603  [SOMC1603]
U11  SOMC1603  [SOMC1603]
U12  SOMC1603  [SOMC1603]
U13  SOMC1603  [SOMC1603]
U14  MC74VHC541DW  [751D-04_M]
U15  MC74VHC541DW  [751D-04_M]
U16  MC74VHC541DW  [751D-04_M]
U17  MC74VHC541DW  [751D-04_M]
U18  MC74VHC541DW  [751D-04_M]
U19  MC74VHC541DW  [751D-04_M]
U20  SOMC1603  [SOMC1603]
U21  SOMC1603  [SOMC1603]
U22  SOMC1603  [SOMC1603]
U23  SOMC1603  [SOMC1603]
U24  SOMC1603  [SOMC1603]
U25  SOMC1603  [SOMC1603]

### Nets
3V3_UNREG: C2.2 C3.2 C4.2 C5.2 C6.2 C7.2 C8.2 C9.2 C10.2 C11.2 C12.2 C13.2 LED6.3(VCC) LED7.3(VCC) LED8.3(VCC) LED9.3(VCC) LED10.3(VCC) LED11.3(VCC) LED12.3(VCC) LED13.3(VCC) LED14.3(VCC) LED15.3(VCC) LED16.3(VCC) LED17.3(VCC) LED19.3(VCC) LED20.3(VCC) LED21.3(VCC) LED22.3(VCC) LED23.3(VCC) LED24.3(VCC) LED25.3(VCC) LED26.3(VCC) LED27.3(VCC) LED28.3(VCC) LED29.3(VCC) LED30.3(VCC) LED31.3(VCC) LED32.3(VCC) LED33.3(VCC) LED34.3(VCC) LED35.3(VCC) LED36.3(VCC) LED38.3(VCC) LED39.3(VCC) LED40.3(VCC) LED41.3(VCC) LED42.3(VCC) LED43.3(VCC) LED44.3(VCC) LED45.3(VCC) LED46.3(VCC) LED47.3(VCC) LED48.3(VCC) LED49.3(VCC) LED50.3(VCC) LED51.3(VCC) LED52.3(VCC) LED53.3(VCC) LED54.3(VCC) LED55.3(VCC) LED63.3(VCC) LED64.3(VCC) LED65.3(VCC) LED66.3(VCC) LED67.3(VCC) LED68.3(VCC) LED69.3(VCC) LED70.3(VCC) LED71.3(VCC) LED72.3(VCC) LED73.3(VCC) LED74.3(VCC) LED75.3(VCC) LED76.3(VCC) LED77.3(VCC) LED78.3(VCC) LED79.3(VCC) LED80.3(VCC) LED82.3(VCC) LED83.3(VCC) LED84.3(VCC) LED85.3(VCC) LED86.3(VCC) LED87.3(VCC) LED88.3(VCC) LED89.3(VCC) LED90.3(VCC) LED91.3(VCC) LED92.3(VCC) LED93.3(VCC) LED94.3(VCC) LED95.3(VCC) LED96.3(VCC) LED97.3(VCC) LED98.3(VCC) LED99.3(VCC) LED101.3(VCC) LED102.3(VCC) LED103.3(VCC) LED104.3(VCC) LED105.3(VCC) LED106.3(VCC) LED107.3(VCC) LED108.3(VCC) LED109.3(VCC) LED111.3(VCC) LED112.3(VCC) R14.2 U2.20(VDD) U3.20(VDD) U4.20(VDD) U5.20(VDD) U6.20(VDD) U7.20(VDD) U14.20(VDD) U15.20(VDD) U16.20(VDD) U17.20(VDD) U18.20(VDD) U19.20(VDD)
GND: C2.1 C3.1 C4.1 C5.1 C6.1 C7.1 C8.1 C9.1 C10.1 C11.1 C12.1 C13.1 LED1.2(K) LED2.2(K) LED3.2(K) LED4.2(K) LED5.2(K) LED6.1(GND) LED7.1(GND) LED8.1(GND) LED9.1(GND) LED10.1(GND) LED11.1(GND) LED12.1(GND) LED13.1(GND) LED14.1(GND) LED15.1(GND) LED16.1(GND) LED17.1(GND) LED18.2(K) LED19.1(GND) LED20.1(GND) LED21.1(GND) LED22.1(GND) LED23.1(GND) LED24.1(GND) LED25.1(GND) LED26.1(GND) LED27.1(GND) LED28.1(GND) LED29.1(GND) LED30.1(GND) LED31.1(GND) LED32.1(GND) LED33.1(GND) LED34.1(GND) LED35.1(GND) LED36.1(GND) LED37.2(K) LED38.1(GND) LED39.1(GND) LED40.1(GND) LED41.1(GND) LED42.1(GND) LED43.1(GND) LED44.1(GND) LED45.1(GND) LED46.1(GND) LED47.1(GND) LED48.1(GND) LED49.1(GND) LED50.1(GND) LED51.1(GND) LED52.1(GND) LED53.1(GND) LED54.1(GND) LED55.1(GND) LED56.2(K) LED57.2(K) LED58.2(K) LED59.2(K) LED60.2(K) LED61.2(K) LED62.2(K) LED63.1(GND) LED64.1(GND) LED65.1(GND) LED66.1(GND) LED67.1(GND) LED68.1(GND) LED69.1(GND) LED70.1(GND) LED71.1(GND) LED72.1(GND) LED73.1(GND) LED74.1(GND) LED75.1(GND) LED76.1(GND) LED77.1(GND) LED78.1(GND) LED79.1(GND) LED80.1(GND) LED81.2(K) LED82.1(GND) LED83.1(GND) LED84.1(GND) LED85.1(GND) LED86.1(GND) LED87.1(GND) LED88.1(GND) LED89.1(GND) LED90.1(GND) LED91.1(GND) LED92.1(GND) LED93.1(GND) LED94.1(GND) LED95.1(GND) LED96.1(GND) LED97.1(GND) LED98.1(GND) LED99.1(GND) LED100.2(K) LED101.1(GND) LED102.1(GND) LED103.1(GND) LED104.1(GND) LED105.1(GND) LED106.1(GND) LED107.1(GND) LED108.1(GND) LED109.1(GND) LED111.1(GND) LED112.1(GND) U2.1(~{OE}1) U2.10(GND) U2.19(~{OE}2) U3.1(~{OE}1) U3.10(GND) U3.19(~{OE}2) U4.1(~{OE}1) U4.10(GND) U4.19(~{OE}2) U5.1(~{OE}1) U5.10(GND) U5.19(~{OE}2) U6.1(~{OE}1) U6.10(GND) U6.19(~{OE}2) U7.1(~{OE}1) U7.10(GND) U7.19(~{OE}2) U14.1(~{OE}1) U14.10(GND) U14.19(~{OE}2) U15.1(~{OE}1) U15.10(GND) U15.19(~{OE}2) U16.1(~{OE}1) U16.10(GND) U16.19(~{OE}2) U17.1(~{OE}1) U17.10(GND) U17.19(~{OE}2) U18.1(~{OE}1) U18.10(GND) U18.19(~{OE}2) U19.1(~{OE}1) U19.19(~{OE}2)
V_LOAD: R13.2
3V3_AUX: R19.2
3V3_COMMS: R17.2
3V3_CSC: R18.2
3V3_PWR: R16.2
3V3_UNREG_PG: U15.8(A7)
5V0_AUX: R23.2
5V0_BBONE: R22.2
5V0_BCR: R20.2
5V0_TELEM: R21.2
5V0_UNREG: R15.2
5V0_UNREG_PG: U15.9(A8)
8V0_RX1: R24.2
8V0_RX2: R26.2
AFSK1_DET: U7.6(A5)
AFSK1_M0: U7.3(A2)
AFSK1_M1: U7.4(A3)
AFSK1_RXD: U7.2(A1)
AFSK1_TXD: U7.5(A4)
AFSK2_DET: U14.3(A2)
AFSK2_M0: U7.8(A7)
AFSK2_M1: U7.9(A8)
AFSK2_RXD: U7.7(A6)
AFSK2_TXD: U14.2(A1)
BB_DEBUG_0: U16.2(A1)
BB_DEBUG_1: U16.3(A2)
BB_DEBUG_2: U16.4(A3)
BB_DEBUG_3: U16.5(A4)
BB_DEBUG_4: U16.6(A5)
BB_DEBUG_5: U16.7(A6)
BB_DEBUG_6: U16.8(A7)
BB_DEBUG_7: U16.9(A8)
BB_DEBUG_8: U17.2(A1)
BB_DEBUG_9: U17.3(A2)
BB_DEBUG_10: U17.4(A3)
BB_DEBUG_11: U17.5(A4)
BB_DEBUG_12: U17.6(A5)
BB_DEBUG_13: U17.7(A6)
BB_DEBUG_14: U17.8(A7)
BBONE_I2C2_SCL: U5.3(A2)
BBONE_I2C2_SDA: U5.2(A1)
DEBUG_0: U3.9(A8)
DEBUG_1: U3.8(A7)
DEBUG_2: U3.7(A6)
DEBUG_3: U3.6(A5)
DEBUG_4: U3.5(A4)
DEBUG_5: U3.4(A3)
DEBUG_6: U3.3(A2)
DEBUG_7: U3.2(A1)
DEBUG_8: U2.9(A8)
DEBUG_9: U2.8(A7)
DEBUG_10: U2.7(A6)
DEBUG_11: U2.6(A5)
DEBUG_12: U2.5(A4)
DEBUG_13: U2.4(A3)
DEBUG_14: U2.3(A2)
DEBUG_15: U2.2(A1)
DTMF1Q1: U4.2(A1)
DTMF1Q2: U4.3(A2)
DTMF1Q3: U4.4(A3)
DTMF1Q4: U4.5(A4)
DTMF1ST: U4.6(A5)
DTMF2Q1: U4.7(A6)
DTMF2Q2: U4.8(A7)
DTMF2Q3: U4.9(A8)
DTMF2Q4: U15.6(A5)
DTMF2ST: U15.7(A6)
I2C0_SCL: U5.5(A4)
I2C0_SDA: U5.4(A3)
I2C1_SCL: U5.7(A6)
I2C1_SDA: U5.6(A5)
I2C2_SCL: U5.9(A8)
I2C2_SDA: U5.8(A7)
RX_S/N1: U14.7(A6)
RX_S/N2: U15.4(A3)
RXDATA1: U14.5(A4)
RXDATA2: U15.2(A1)
RXHOLD1: U14.8(A7)
RXHOLD2: U15.5(A4)
S0: U6.2(A1)
S1: U6.3(A2)
S2: U6.4(A3)
S3: U6.5(A4)
S4: U6.6(A5)
S5: U6.7(A6)
S6: U6.8(A7)
S7: U6.9(A8)
TXDATA1: U14.4(A3)
TXDATA2: U14.9(A8)
TXEN1: U14.6(A5)
TXEN2: U15.3(A2)
V_BATT: R12.2
VVAR_TX1: R25.2
VVAR_TX2: R27.2
NetJ35_1: J35.1 U18.2(A1)
NetJ35_2: J35.2 U18.3(A2)
NetJ35_3: J35.3 U18.4(A3)
NetJ35_4: J35.4 U18.5(A4)
NetJ35_5: J35.5 U18.6(A5)
NetJ35_6: J35.6 U18.7(A6)
NetJ35_7: J35.7 U18.8(A7)
NetJ35_8: J35.8 U18.9(A8)
NetJ36_1: J36.1 U19.2(A1)
NetJ36_2: J36.2 U19.3(A2)
NetJ36_3: J36.3 U19.4(A3)
NetJ36_4: J36.4 U19.5(A4)
NetJ36_5: J36.5 U19.6(A5)
NetJ36_6: J36.6 U19.7(A6)
NetJ36_7: J36.7 U19.8(A7)
NetJ36_8: J36.8 U19.9(A8)
NetLED1_1: LED1.1(A) R12.1
NetLED2_1: LED2.1(A) R13.1
NetLED3_1: LED3.1(A) R14.1
NetLED4_1: LED4.1(A) R15.1
NetLED5_1: LED5.1(A) R16.1
NetLED6_2: LED6.2(RES) U8.16(1B)
NetLED7_2: LED7.2(RES) U9.16(1B)
NetLED8_2: LED8.2(RES) U10.16(1B)
NetLED9_2: LED9.2(RES) U21.12(5B)
NetLED10_2: LED10.2(RES) U12.16(1B)
NetLED11_2: LED11.2(RES) U13.16(1B)
NetLED12_2: LED12.2(RES) U8.15(2B)
NetLED13_2: LED13.2(RES) U9.15(2B)
NetLED14_2: LED14.2(RES) U10.15(2B)
NetLED15_2: LED15.2(RES) U21.11(6B)
NetLED16_2: LED16.2(RES) U12.15(2B)
NetLED17_2: LED17.2(RES) U13.15(2B)
NetLED18_1: LED18.1(A) R17.1
NetLED19_2: LED19.2(RES) U8.14(3B)
NetLED20_2: LED20.2(RES) U9.14(3B)
NetLED21_2: LED21.2(RES) U10.14(3B)
NetLED22_2: LED22.2(RES) U11.14(3B)
NetLED23_2: LED23.2(RES) U12.14(3B)
NetLED24_2: LED24.2(RES) U13.14(3B)
NetLED25_2: LED25.2(RES) U8.13(4B)
NetLED26_2: LED26.2(RES) U9.13(4B)
NetLED27_2: LED27.2(RES) U10.13(4B)
NetLED28_2: LED28.2(RES) U11.13(4B)
NetLED29_2: LED29.2(RES) U12.13(4B)
NetLED30_2: LED30.2(RES) U13.13(4B)
NetLED31_2: LED31.2(RES) U8.12(5B)
NetLED32_2: LED32.2(RES) U9.12(5B)
NetLED33_2: LED33.2(RES) U10.12(5B)
NetLED34_2: LED34.2(RES) U11.12(5B)
NetLED35_2: LED35.2(RES) U12.12(5B)
NetLED36_2: LED36.2(RES) U13.12(5B)
NetLED37_1: LED37.1(A) R18.1
NetLED38_2: LED38.2(RES) U8.11(6B)
NetLED39_2: LED39.2(RES) U9.11(6B)
NetLED40_2: LED40.2(RES) U10.11(6B)
NetLED41_2: LED41.2(RES) U11.11(6B)
NetLED42_2: LED42.2(RES) U12.11(6B)
NetLED43_2: LED43.2(RES) U13.11(6B)
NetLED44_2: LED44.2(RES) U8.10(7B)
NetLED45_2: LED45.2(RES) U9.10(7B)
NetLED46_2: LED46.2(RES) U10.10(7B)
NetLED47_2: LED47.2(RES) U11.10(7B)
NetLED48_2: LED48.2(RES) U12.10(7B)
NetLED49_2: LED49.2(RES) U13.10(7B)
NetLED50_2: LED50.2(RES) U8.9(8B)
NetLED51_2: LED51.2(RES) U9.9(8B)
NetLED52_2: LED52.2(RES) U10.9(8B)
NetLED53_2: LED53.2(RES) U11.9(8B)
NetLED54_2: LED54.2(RES) U12.9(8B)
NetLED55_2: LED55.2(RES) U13.9(8B)
NetLED56_1: LED56.1(A) R19.1
NetLED57_1: LED57.1(A) R20.1
NetLED58_1: LED58.1(A) R21.1
NetLED59_1: LED59.1(A) R22.1
NetLED60_1: LED60.1(A) R23.1
NetLED61_1: LED61.1(A) R24.1
NetLED62_1: LED62.1(A) R25.1
NetLED63_2: LED63.2(RES) U20.16(1B)
NetLED64_2: LED64.2(RES) U21.16(1B)
NetLED65_2: LED65.2(RES) U22.16(1B)
NetLED66_2: LED66.2(RES) U23.16(1B)
NetLED67_2: LED67.2(RES) U24.16(1B)
NetLED68_2: LED68.2(RES) U25.16(1B)
NetLED69_2: LED69.2(RES) U20.15(2B)
NetLED70_2: LED70.2(RES) U21.15(2B)
NetLED71_2: LED71.2(RES) U22.15(2B)
NetLED72_2: LED72.2(RES) U23.15(2B)
NetLED73_2: LED73.2(RES) U24.15(2B)
NetLED74_2: LED74.2(RES) U25.15(2B)
NetLED75_2: LED75.2(RES) U20.14(3B)
NetLED76_2: LED76.2(RES) U21.14(3B)
NetLED77_2: LED77.2(RES) U22.14(3B)
NetLED78_2: LED78.2(RES) U23.14(3B)
NetLED79_2: LED79.2(RES) U24.14(3B)
NetLED80_2: LED80.2(RES) U25.14(3B)
NetLED81_1: LED81.1(A) R26.1
NetLED82_2: LED82.2(RES) U20.13(4B)
NetLED83_2: LED83.2(RES) U21.13(4B)
NetLED84_2: LED84.2(RES) U22.13(4B)
NetLED85_2: LED85.2(RES) U23.13(4B)
NetLED86_2: LED86.2(RES) U24.13(4B)
NetLED87_2: LED87.2(RES) U25.13(4B)
NetLED88_2: LED88.2(RES) U20.12(5B)
NetLED89_2: LED89.2(RES) U11.16(1B)
NetLED90_2: LED90.2(RES) U22.12(5B)
NetLED91_2: LED91.2(RES) U23.12(5B)
NetLED92_2: LED92.2(RES) U24.12(5B)
NetLED93_2: LED93.2(RES) U25.12(5B)
NetLED94_2: LED94.2(RES) U20.11(6B)
NetLED95_2: LED95.2(RES) U11.15(2B)
NetLED96_2: LED96.2(RES) U22.11(6B)
NetLED97_2: LED97.2(RES) U23.11(6B)
NetLED98_2: LED98.2(RES) U24.11(6B)
NetLED99_2: LED99.2(RES) U25.11(6B)
NetLED100_1: LED100.1(A) R27.1
NetLED101_2: LED101.2(RES) U20.10(7B)
NetLED102_2: LED102.2(RES) U21.10(7B)
NetLED103_2: LED103.2(RES) U22.10(7B)
NetLED104_2: LED104.2(RES) U23.10(7B)
NetLED105_2: LED105.2(RES) U24.10(7B)
NetLED106_2: LED106.2(RES) U25.10(7B)
NetLED107_2: LED107.2(RES) U20.9(8B)
NetLED108_2: LED108.2(RES) U21.9(8B)
NetLED109_2: LED109.2(RES) U22.9(8B)
NetLED111_2: LED111.2(RES) U24.9(8B)
NetLED112_2: LED112.2(RES) U25.9(8B)
NetU2_11: U2.11(Y8) U8.8(8A)
NetU2_12: U2.12(Y7) U8.7(7A)
NetU2_13: U2.13(Y6) U8.6(6A)
NetU2_14: U2.14(Y5) U8.5(5A)
NetU2_15: U2.15(Y4) U8.4(4A)
NetU2_16: U2.16(Y3) U8.3(3A)
NetU2_17: U2.17(Y2) U8.2(2A)
NetU2_18: U2.18(Y1) U8.1(1A)
NetU3_11: U3.11(Y8) U9.8(8A)
NetU3_12: U3.12(Y7) U9.7(7A)
NetU3_13: U3.13(Y6) U9.6(6A)
NetU3_14: U3.14(Y5) U9.5(5A)
NetU3_15: U3.15(Y4) U9.4(4A)
NetU3_16: U3.16(Y3) U9.3(3A)
NetU3_17: U3.17(Y2) U9.2(2A)
NetU3_18: U3.18(Y1) U9.1(1A)
NetU4_11: U4.11(Y8) U10.8(8A)
NetU4_12: U4.12(Y7) U10.7(7A)
NetU4_13: U4.13(Y6) U10.6(6A)
NetU4_14: U4.14(Y5) U10.5(5A)
NetU4_15: U4.15(Y4) U10.4(4A)
NetU4_16: U4.16(Y3) U10.3(3A)
NetU4_17: U4.17(Y2) U10.2(2A)
NetU4_18: U4.18(Y1) U10.1(1A)
NetU5_11: U5.11(Y8) U11.8(8A)
NetU5_12: U5.12(Y7) U11.7(7A)
NetU5_13: U5.13(Y6) U11.6(6A)
NetU5_14: U5.14(Y5) U11.5(5A)
NetU5_15: U5.15(Y4) U11.4(4A)
NetU5_16: U5.16(Y3) U11.3(3A)
NetU5_17: U5.17(Y2) U11.2(2A)
NetU5_18: U5.18(Y1) U11.1(1A)
NetU6_11: U6.11(Y8) U12.8(8A)
NetU6_12: U6.12(Y7) U12.7(7A)
NetU6_13: U6.13(Y6) U12.6(6A)
NetU6_14: U6.14(Y5) U12.5(5A)
NetU6_15: U6.15(Y4) U12.4(4A)
NetU6_16: U6.16(Y3) U12.3(3A)
NetU6_17: U6.17(Y2) U12.2(2A)
NetU6_18: U6.18(Y1) U12.1(1A)
NetU7_11: U7.11(Y8) U13.8(8A)
NetU7_12: U7.12(Y7) U13.7(7A)
NetU7_13: U7.13(Y6) U13.6(6A)
NetU7_14: U7.14(Y5) U13.5(5A)
NetU7_15: U7.15(Y4) U13.4(4A)
NetU7_16: U7.16(Y3) U13.3(3A)
NetU7_17: U7.17(Y2) U13.2(2A)
NetU7_18: U7.18(Y1) U13.1(1A)
NetU14_11: U14.11(Y8) U20.8(8A)
NetU14_12: U14.12(Y7) U20.7(7A)
NetU14_13: U14.13(Y6) U20.6(6A)
NetU14_14: U14.14(Y5) U20.5(5A)
NetU14_15: U14.15(Y4) U20.4(4A)
NetU14_16: U14.16(Y3) U20.3(3A)
NetU14_17: U14.17(Y2) U20.2(2A)
NetU14_18: U14.18(Y1) U20.1(1A)
NetU15_11: U15.11(Y8) U21.8(8A)
NetU15_12: U15.12(Y7) U21.7(7A)
NetU15_13: U15.13(Y6) U21.6(6A)
NetU15_14: U15.14(Y5) U21.5(5A)
NetU15_15: U15.15(Y4) U21.4(4A)
NetU15_16: U15.16(Y3) U21.3(3A)
NetU15_17: U15.17(Y2) U21.2(2A)
NetU15_18: U15.18(Y1) U21.1(1A)
NetU16_11: U16.11(Y8) U22.8(8A)
NetU16_12: U16.12(Y7) U22.7(7A)
NetU16_13: U16.13(Y6) U22.6(6A)
NetU16_14: U16.14(Y5) U22.5(5A)
NetU16_15: U16.15(Y4) U22.4(4A)
NetU16_16: U16.16(Y3) U22.3(3A)
NetU16_17: U16.17(Y2) U22.2(2A)
NetU16_18: U16.18(Y1) U22.1(1A)
NetU17_11: U17.11(Y8) U23.8(8A)
NetU17_12: U17.12(Y7) U23.7(7A)
NetU17_13: U17.13(Y6) U23.6(6A)
NetU17_14: U17.14(Y5) U23.5(5A)
NetU17_15: U17.15(Y4) U23.4(4A)
NetU17_16: U17.16(Y3) U23.3(3A)
NetU17_17: U17.17(Y2) U23.2(2A)
NetU17_18: U17.18(Y1) U23.1(1A)
NetU18_11: U18.11(Y8) U24.8(8A)
NetU18_12: U18.12(Y7) U24.7(7A)
NetU18_13: U18.13(Y6) U24.6(6A)
NetU18_14: U18.14(Y5) U24.5(5A)
NetU18_15: U18.15(Y4) U24.4(4A)
NetU18_16: U18.16(Y3) U24.3(3A)
NetU18_17: U18.17(Y2) U24.2(2A)
NetU18_18: U18.18(Y1) U24.1(1A)
NetU19_11: U19.11(Y8) U25.8(8A)
NetU19_12: U19.12(Y7) U25.7(7A)
NetU19_13: U19.13(Y6) U25.6(6A)
NetU19_14: U19.14(Y5) U25.5(5A)
NetU19_15: U19.15(Y4) U25.4(4A)
NetU19_16: U19.16(Y3) U25.3(3A)
NetU19_17: U19.17(Y2) U25.2(2A)
NetU19_18: U19.18(Y1) U25.1(1A)

Not connected (* = marked no-connect by the designer): U17 9(A8)*; U19 10(GND); U23 9(8B)*

### Library data of the parts
C2-C13 = Cap: Capacitor; Published: 8-Jun-2000; LatestRevisionDate: 17-Jul-2002; LatestRevisionNote: Re-released for DXP Platform.; PackageReference: RAD-0.3; Publisher: Altium Limited; PackageDescription: Radial Cap, Thru-Hole; 2 Leads; 0.3 in Pin Spacing
  C2: ClassName: LED_BANK_1
  C3: ClassName: LED_BANK_2
  C4: ClassName: LED_BANK_3
  C5: ClassName: LED_BANK_4
  C6: ClassName: LED_BANK_5
  C7: ClassName: LED_BANK_6
  C8: ClassName: LED_BANK_7
  C9: ClassName: LED_BANK_8
  C10: ClassName: LED_BANK_9
  C11: ClassName: LED_BANK_10
  C12: ClassName: LED_BANK_11
  C13: ClassName: LED_BANK_12
J35 J36 = Header 8: Header, 8-Pin; LatestRevisionDate: 17-Jul-2002; LatestRevisionNote: Re-released for DXP Platform.; Publisher: Altium Limited
  J35: ClassName: LED_BANK_11
  J36: ClassName: LED_BANK_12
LED1-LED5 LED18 LED37 LED56-LED62 LED81 LED100 = LED0: Typical INFRARED GaAs LED; Published: 8-Jun-2000; LatestRevisionDate: 08-Jul-2005; LatestRevisionNote: Mech Layer 1 removed.; PackageReference: LED-0; Publisher: Altium Limited; PackageDescription: LED; 2 Leads; ClassName: LED_BANK_PWR
LED6-LED17 LED19-LED36 LED38-LED55 LED63-LED80 LED82-LED99 LED101-LED109 LED111 LED112 = BIDIRECTIONAL LED
  LED6 LED12 LED19 LED25 LED31 LED38 LED44 LED50: ClassName: LED_BANK_1
  LED7 LED13 LED20 LED26 LED32 LED39 LED45 LED51: ClassName: LED_BANK_2
  LED8 LED14 LED21 LED27 LED33 LED40 LED46 LED52: ClassName: LED_BANK_3
  LED9 LED15 LED22 LED28 LED34 LED41 LED47 LED53: ClassName: LED_BANK_4
  LED10 LED16 LED23 LED29 LED35 LED42 LED48 LED54: ClassName: LED_BANK_5
  LED11 LED17 LED24 LED30 LED36 LED43 LED49 LED55: ClassName: LED_BANK_6
  LED63 LED69 LED75 LED82 LED88 LED94 LED101 LED107: ClassName: LED_BANK_7
  LED64 LED70 LED76 LED83 LED89 LED95 LED102 LED108: ClassName: LED_BANK_8
  LED65 LED71 LED77 LED84 LED90 LED96 LED103 LED109: ClassName: LED_BANK_9
  LED66 LED72 LED78 LED85 LED91 LED97 LED104: ClassName: LED_BANK_10
  LED67 LED73 LED79 LED86 LED92 LED98 LED105 LED111: ClassName: LED_BANK_11
  LED68 LED74 LED80 LED87 LED93 LED99 LED106 LED112: ClassName: LED_BANK_12
R12-R27 = Res2: Resistor; Value: 1K; Published: 8-Jun-2000; LatestRevisionDate: 17-Jul-2002; LatestRevisionNote: Re-released for DXP Platform.; PackageReference: AXIAL-0.4; Publisher: Altium Limited; PackageDescription: Axial Device, Thru-Hole; 2 Leads; 0.4 in Pin Spacing; ClassName: LED_BANK_PWR
U2-U7 U14-U19 = MC74VHC541DW: Octal Bus Buffer; Published: 15-Apr-2002; LatestRevisionDate: 13-Apr-2006; LatestRevisionNote: IPC-7351 Footprint Added.; DatasheetVersion: 1998; PackageReference: 751D-04; Publisher: Altium Limited; PackageDescription: 20-Pin Small Outline Integrated Circuit 1.27 mm Pitch; ComponentLink1Description: Manufacturer Link; ComponentLink1URL: http://www.onsemi.com/; ComponentLink2Description: Datasheet; ComponentLink2URL: http://www.onsemi.com/pub/Collateral/MC74VHC541-D.PDF
  U2: ClassName: LED_BANK_1
  U3: ClassName: LED_BANK_2
  U4: ClassName: LED_BANK_3
  U5: ClassName: LED_BANK_4
  U6: ClassName: LED_BANK_5
  U7: ClassName: LED_BANK_6
  U14: ClassName: LED_BANK_7
  U15: ClassName: LED_BANK_8
  U16: ClassName: LED_BANK_9
  U17: ClassName: LED_BANK_10
  U18: ClassName: LED_BANK_11
  U19: ClassName: LED_BANK_12
U8-U13 U20-U25 = SOMC1603
  U8: ClassName: LED_BANK_1
  U9: ClassName: LED_BANK_2
  U10: ClassName: LED_BANK_3
  U11: ClassName: LED_BANK_4
  U12: ClassName: LED_BANK_5
  U13: ClassName: LED_BANK_6
  U20: ClassName: LED_BANK_7
  U21: ClassName: LED_BANK_8
  U22: ClassName: LED_BANK_9
  U23: ClassName: LED_BANK_10
  U24: ClassName: LED_BANK_11
  U25: ClassName: LED_BANK_12

## Nets that join several sheets
3V3_UNREG: PWR_REG (9 pins), LED_INDICATORS (120 pins)
GND: PWR_GEN (141 pins), PWR_REG (158 pins), LED_INDICATORS (158 pins)
V_LOAD: PWR_GEN (D1.2), PWR_REG (16 pins), LED_INDICATORS (R13.2)
3V3_AUX: PWR_REG (P520.1), LED_INDICATORS (R19.2)
3V3_COMMS: PWR_REG (P526.1), LED_INDICATORS (R17.2)
3V3_CSC: PWR_REG (P523.1), LED_INDICATORS (R18.2)
3V3_PWR: PWR_GEN (P393.1 P394.1), PWR_REG (P436.1 P442.1 P517.1), LED_INDICATORS (R16.2)
3V3_UNREG_PG: PWR_REG (P485.1), LED_INDICATORS (U15.8)
5V0_AUX: PWR_REG (P535.1), LED_INDICATORS (R23.2)
5V0_BBONE: PWR_REG (P538.1), LED_INDICATORS (R22.2)
5V0_BCR: PWR_GEN (P395.1), PWR_REG (P532.1), LED_INDICATORS (R20.2)
5V0_TELEM: PWR_REG (P529.1), LED_INDICATORS (R21.2)
5V0_UNREG: PWR_REG (9 pins), LED_INDICATORS (R15.2)
5V0_UNREG_PG: PWR_REG (P497.1), LED_INDICATORS (U15.9)
8V0_RX1: PWR_REG (P457.1 P458.1), LED_INDICATORS (R24.2)
8V0_RX2: PWR_REG (P469.1 P470.1), LED_INDICATORS (R26.2)
I2C0_SCL: PWR_GEN (P410.1), PWR_REG (P438.1 P444.1), LED_INDICATORS (U5.5)
I2C0_SDA: PWR_GEN (P409.1), PWR_REG (P437.1 P443.1), LED_INDICATORS (U5.4)
I2C2_SCL: PWR_GEN (P411.1), LED_INDICATORS (U5.9)
I2C2_SDA: PWR_GEN (P412.1), LED_INDICATORS (U5.8)
V_BATT: PWR_GEN (7 pins), LED_INDICATORS (R12.2)
VVAR_TX1: PWR_REG (P459.1 P460.1), LED_INDICATORS (R25.2)
VVAR_TX2: PWR_REG (P471.1 P472.1), LED_INDICATORS (R27.2)